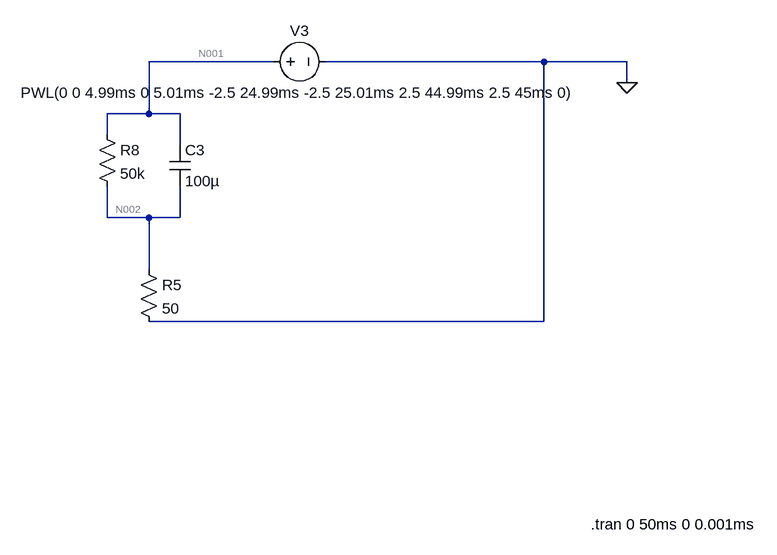
[diagram p0: schematic 電圧刺激等価回路_test2.asc]
電圧刺激等価回路_test2.asc, the LTspice schematic file:
Version 4
SHEET 1 1116 680
WIRE 320 -368 128 -368
WIRE 736 -368 400 -368
WIRE 864 -368 736 -368
WIRE 864 -336 864 -368
WIRE 128 -288 128 -368
WIRE 128 -288 64 -288
WIRE 176 -288 128 -288
WIRE 64 -256 64 -288
WIRE 176 -240 176 -288
WIRE 64 -128 64 -176
WIRE 128 -128 64 -128
WIRE 176 -128 176 -176
WIRE 176 -128 128 -128
WIRE 128 -48 128 -128
WIRE 736 32 736 -368
WIRE 736 32 128 32
FLAG 864 -336 0
SYMBOL voltage 304 -368 R270
WINDOW 0 32 56 VTop 2
WINDOW 3 -32 56 VBottom 2
WINDOW 123 0 0 Left 0
WINDOW 39 0 0 Left 0
SYMATTR InstName V3
SYMATTR Value PWL(0 0 4.99ms 0 5.01ms -2.5 24.99ms -2.5 25.01ms 2.5 44.99ms 2.5 45ms 0)
SYMBOL res 112 -64 R0
SYMATTR InstName R5
SYMATTR Value 50
SYMBOL cap 160 -240 R0
SYMATTR InstName C3
SYMATTR Value 100µ
SYMBOL res 48 -272 R0
SYMATTR InstName R8
SYMATTR Value 50k
TEXT 808 344 Left 2 !.tran 0 50ms 0 0.001ms

The netlist it stands for:
* 電圧刺激等価回路_test2.asc
V3 N001 0 PWL(0 0 4.99ms 0 5.01ms -2.5 24.99ms -2.5 25.01ms 2.5 44.99ms 2.5 45ms 0)
R5 N002 0 50
C3 N001 N002 100µ
R8 N001 N002 50k
.tran 0 50ms 0 0.001ms
.backanno
.end

* Results of the author's LTspice run, read from the files saved beside the schematic
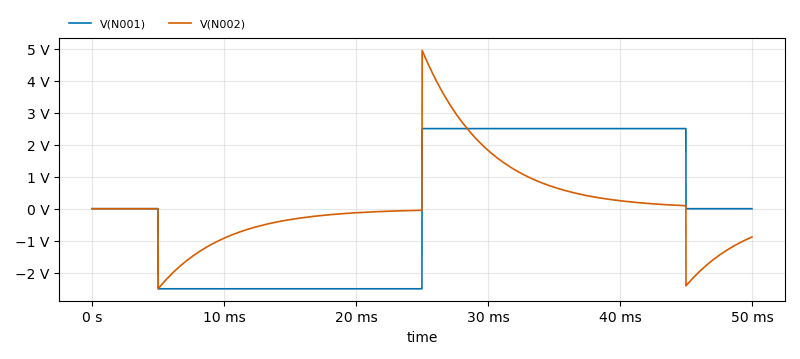
[diagram p1: Transient Analysis of 電圧刺激等価回路_test2.asc, plotted from the saved traces]
* Transient Analysis, 1 run:
*   V(N001): min -2.5 V, max 2.5 V, average -250 µV, rms 2.236 V, last 0 V
*   V(N002): min -2.495 V, max 4.942 V, average 88.32 mV, rms 1.339 V, last -883.8 mV